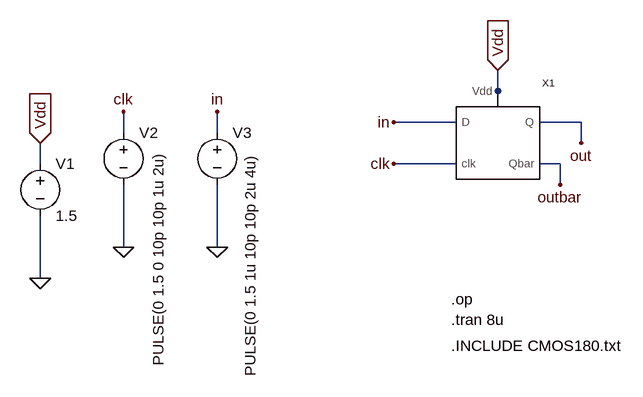
[diagram p0: schematic dff_tb.asc]
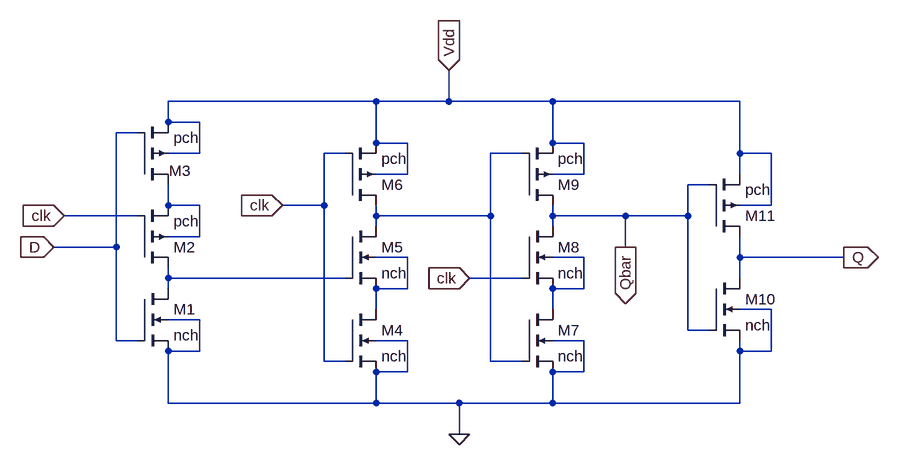
[diagram p1: sub-circuit dff_sym.asc]
dff_tb.asc, the LTspice schematic file:
Version 4
SHEET 1 1948 680
WIRE 1008 64 1008 32
WIRE 1008 80 1008 64
WIRE 944 112 848 112
WIRE 1136 112 1072 112
WIRE 432 128 432 96
WIRE 576 128 576 96
WIRE 1136 144 1136 112
WIRE 304 176 304 144
WIRE 944 176 848 176
WIRE 1104 176 1072 176
WIRE 1104 208 1104 176
WIRE 432 304 432 208
WIRE 576 304 576 208
WIRE 304 352 304 256
FLAG 432 304 0
FLAG 576 304 0
FLAG 576 96 in
FLAG 432 96 clk
FLAG 848 112 in
FLAG 848 176 clk
FLAG 1136 144 out
FLAG 304 352 0
FLAG 304 144 Vdd
IOPIN 304 144 In
FLAG 1008 32 Vdd
IOPIN 1008 32 In
FLAG 1104 208 outbar
SYMBOL voltage 432 112 R0
WINDOW 3 54 45 VRight 2
WINDOW 123 0 0 Left 0
WINDOW 39 0 0 Left 0
SYMATTR Value PULSE(0 1.5 0 10p 10p 1u 2u)
SYMATTR InstName V2
SYMBOL voltage 576 112 R0
WINDOW 3 51 47 VRight 2
WINDOW 123 0 0 Left 0
WINDOW 39 0 0 Left 0
SYMATTR Value PULSE(0 1.5 1u 10p 10p 2u 4u)
SYMATTR InstName V3
SYMBOL dff_sym 1008 144 R0
SYMATTR InstName X1
SYMBOL voltage 304 160 R0
WINDOW 123 0 0 Left 0
WINDOW 39 0 0 Left 0
SYMATTR InstName V1
SYMATTR Value 1.5
TEXT 936 416 Left 2 !.tran 8u
TEXT 936 456 Left 2 !.INCLUDE CMOS180.txt
TEXT 936 384 Left 2 !.op

dff_sym.asc, the sub-circuit schematic file:
Version 4
SHEET 1 1948 680
WIRE 1056 -128 736 -128
WIRE 1168 -128 1168 -176
WIRE 1168 -128 1056 -128
WIRE 1328 -128 1168 -128
WIRE 1616 -128 1328 -128
WIRE 736 -96 736 -128
WIRE 784 -96 736 -96
WIRE 688 -80 656 -80
WIRE 1056 -64 1056 -128
WIRE 1104 -64 1056 -64
WIRE 1328 -64 1328 -128
WIRE 1376 -64 1328 -64
WIRE 784 -48 784 -96
WIRE 784 -48 736 -48
WIRE 1008 -48 976 -48
WIRE 1280 -48 1232 -48
WIRE 1616 -48 1616 -128
WIRE 1664 -48 1616 -48
WIRE 1104 -16 1104 -64
WIRE 1104 -16 1056 -16
WIRE 1376 -16 1376 -64
WIRE 1376 -16 1328 -16
WIRE 1616 -16 1616 -48
WIRE 1568 0 1536 0
WIRE 736 32 736 0
WIRE 784 32 736 32
WIRE 976 32 976 -48
WIRE 976 32 912 32
WIRE 1664 32 1664 -48
WIRE 1664 32 1616 32
WIRE 688 48 576 48
WIRE 1056 48 1056 32
WIRE 1232 48 1232 -48
WIRE 1232 48 1056 48
WIRE 1328 48 1328 32
WIRE 1440 48 1328 48
WIRE 1536 48 1536 0
WIRE 1536 48 1440 48
WIRE 1056 64 1056 48
WIRE 1328 64 1328 48
WIRE 784 80 784 32
WIRE 784 80 736 80
WIRE 656 96 656 -80
WIRE 656 96 560 96
WIRE 1440 96 1440 48
WIRE 1104 112 1056 112
WIRE 1376 112 1328 112
WIRE 1616 112 1616 80
WIRE 1776 112 1616 112
WIRE 736 144 736 128
WIRE 1008 144 736 144
WIRE 1280 144 1200 144
WIRE 1616 144 1616 112
WIRE 736 160 736 144
WIRE 1104 160 1104 112
WIRE 1104 160 1056 160
WIRE 1376 160 1376 112
WIRE 1376 160 1328 160
WIRE 1056 192 1056 160
WIRE 1328 192 1328 160
WIRE 1664 192 1616 192
WIRE 784 208 736 208
WIRE 1536 224 1536 48
WIRE 1568 224 1536 224
WIRE 656 240 656 96
WIRE 688 240 656 240
WIRE 1104 240 1056 240
WIRE 1376 240 1328 240
WIRE 784 256 784 208
WIRE 784 256 736 256
WIRE 1616 256 1616 240
WIRE 1664 256 1664 192
WIRE 1664 256 1616 256
WIRE 976 272 976 32
WIRE 1008 272 976 272
WIRE 1232 272 1232 48
WIRE 1280 272 1232 272
WIRE 1104 288 1104 240
WIRE 1104 288 1056 288
WIRE 1376 288 1376 240
WIRE 1376 288 1328 288
WIRE 736 336 736 256
WIRE 1056 336 1056 288
WIRE 1056 336 736 336
WIRE 1184 336 1056 336
WIRE 1328 336 1328 288
WIRE 1328 336 1184 336
WIRE 1616 336 1616 256
WIRE 1616 336 1328 336
WIRE 1184 384 1184 336
FLAG 576 48 clk
IOPIN 576 48 In
FLAG 1776 112 Q
IOPIN 1776 112 Out
FLAG 560 96 D
IOPIN 560 96 In
FLAG 912 32 clk
IOPIN 912 32 In
FLAG 1200 144 clk
IOPIN 1200 144 In
FLAG 1168 -176 Vdd
IOPIN 1168 -176 In
FLAG 1440 96 Qbar
IOPIN 1440 96 Out
FLAG 1184 384 0
SYMBOL pmos4 688 0 M180
WINDOW 0 49 21 Left 2
SYMATTR Value2 l=180n w=1.44u
SYMATTR InstName M3
SYMATTR Value pch
SYMBOL pmos4 1008 32 M180
SYMATTR Value2 l=180n w=0.72u
SYMATTR InstName M6
SYMATTR Value pch
SYMBOL pmos4 1280 32 M180
SYMATTR Value2 l=180n w=0.72u
SYMATTR InstName M9
SYMATTR Value pch
SYMBOL pmos4 1568 80 M180
SYMATTR Value2 l=180n w=0.72u
SYMATTR InstName M11
SYMATTR Value pch
SYMBOL pmos4 688 128 M180
SYMATTR Value2 l=180n w=1.44u
SYMATTR InstName M2
SYMATTR Value pch
SYMBOL nmos4 688 160 R0
SYMATTR Value2 l=180n w=0.36u
SYMATTR InstName M1
SYMATTR Value nch
SYMBOL nmos4 1008 64 R0
SYMATTR Value2 l=180n w=0.72u
SYMATTR InstName M5
SYMATTR Value nch
SYMBOL nmos4 1008 192 R0
SYMATTR Value2 l=180n w=0.72u
SYMATTR InstName M4
SYMATTR Value nch
SYMBOL nmos4 1280 64 R0
SYMATTR Value2 l=180n w=0.72u
SYMATTR InstName M8
SYMATTR Value nch
SYMBOL nmos4 1280 192 R0
SYMATTR Value2 l=180n w=0.72u
SYMATTR InstName M7
SYMATTR Value nch
SYMBOL nmos4 1568 144 R0
SYMATTR Value2 l=180n w=0.36u
SYMATTR InstName M10
SYMATTR Value nch

The netlist it stands for:
* dff_tb.asc
V2 clk 0 PULSE(0 1.5 0 10p 10p 1u 2u)
V3 in 0 PULSE(0 1.5 1u 10p 10p 2u 4u)
XX1 clk in Vdd out outbar dff_sym
V1 Vdd 0 1.5

* block symbol definitions
.subckt dff_sym clk D Vdd Q Qbar
M3 N002 D Vdd Vdd pch l=180n w=1.44u
M6 N001 clk Vdd Vdd pch l=180n w=0.72u
M9 Qbar N001 Vdd Vdd pch l=180n w=0.72u
M11 Q Qbar Vdd Vdd pch l=180n w=0.72u
M2 N005 clk N002 N002 pch l=180n w=1.44u
M1 N005 D 0 0 nch l=180n w=0.36u
M5 N001 N005 N003 N003 nch l=180n w=0.72u
M4 N003 clk 0 0 nch l=180n w=0.72u
M8 Qbar clk N004 N004 nch l=180n w=0.72u
M7 N004 N001 0 0 nch l=180n w=0.72u
M10 Q Qbar 0 0 nch l=180n w=0.36u
.ends dff_sym

.model NMOS NMOS
.model PMOS PMOS
.lib standard.mos
.tran 8u
.INCLUDE CMOS180.txt
.op
.backanno
.end